# Altium schematic sheet Template.SchDoc
size A3; Organization: Altium Limited; Address1: L3, 12a Rodborough Rd; Address2: Frenchs Forest; Address3: NSW; Address4: Australia 2086
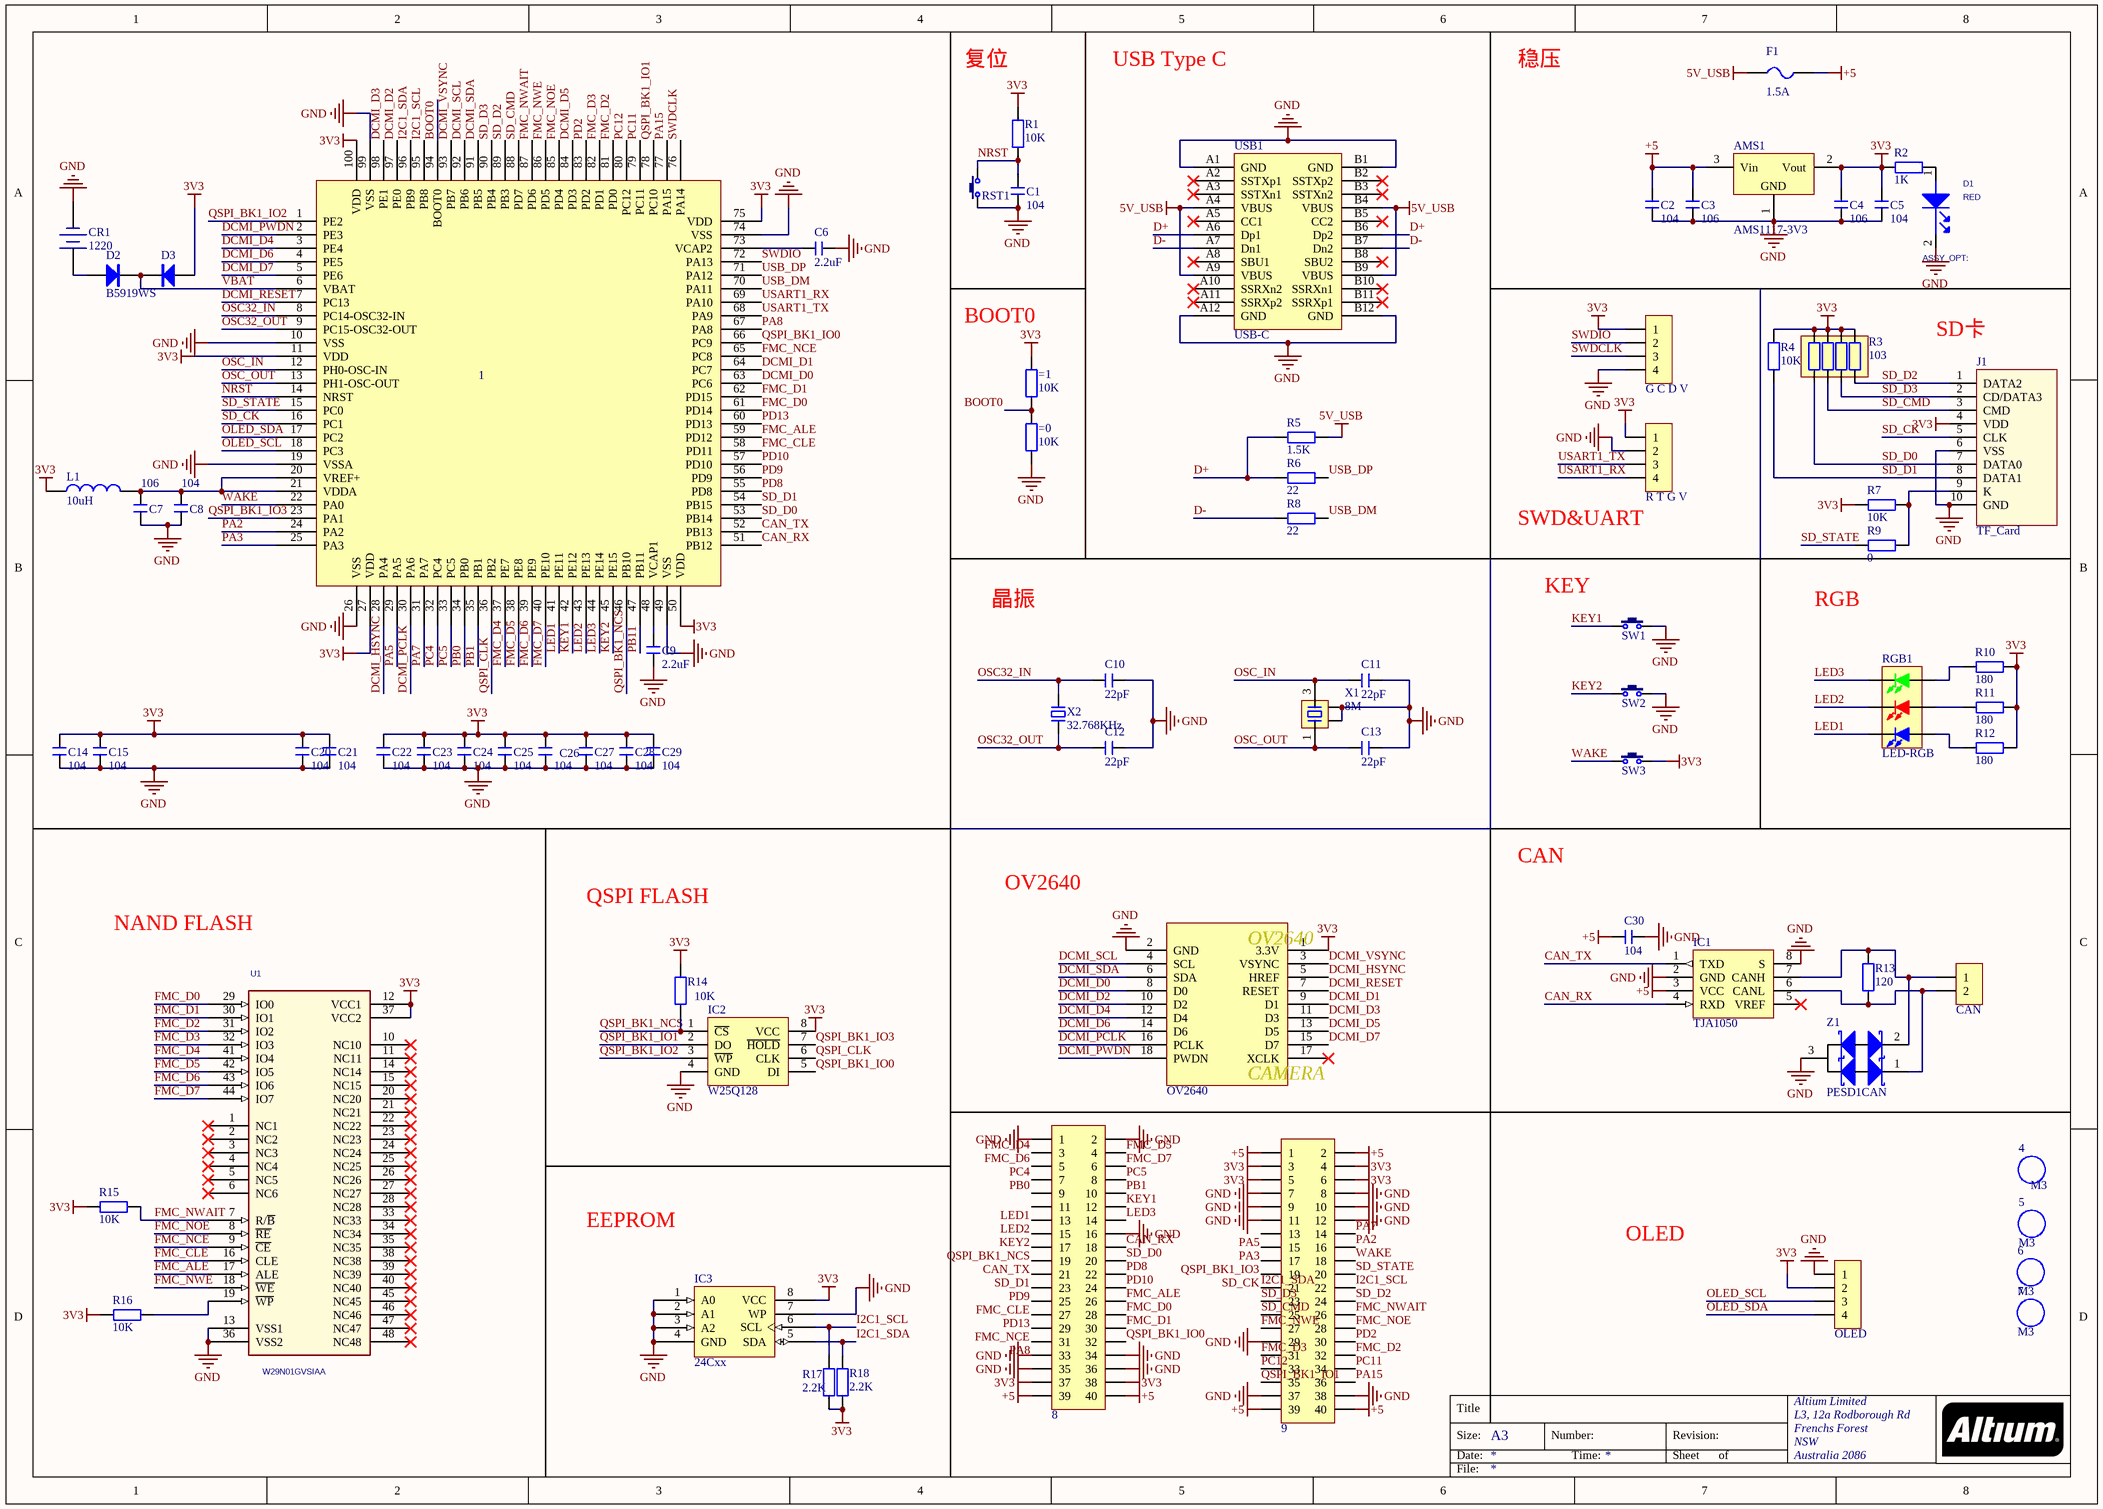
[diagram p0: Template.SchDoc]

## Parts
1  (no value)  [LQFP100 14x14_M]
4  M3  [M3 125X200]
5  M3  [M3 125X200]
6  M3  [M3 125X200]
7  M3  [M3 125X200]
8  Header 2X11  [HDR2.54-LI-2x20P]  (value not drawn)
9  Header 2X11  [HDR2.54-LI-2x20P]  (value not drawn)
=0  10K  [R 0603_L]
=1  10K  [R 0603_L]
AMS1  AMS1117-3V3  [SOT223_N]
C1  104  [C 0603_L]
C2  104  [C 0603_L]
C3  106  [C 0805_M]
C4  106  [C 0805_M]
C5  104  [C 0603_L]
C6  2.2uF  [C 0603_L]
C7  106  [C 0805_M]
C8  104  [C 0603_L]
C9  2.2uF  [C 0603_L]
C10  22pF  [C 0603_L]
C11  22pF  [C 0603_L]
C12  22pF  [C 0603_L]
C13  22pF  [C 0603_L]
C14  104  [C 0603_L]
C15  104  [C 0603_L]
C20  104  [C 0603_L]
C21  104  [C 0603_L]
C22  104  [C 0603_L]
C23  104  [C 0603_L]
C24  104  [C 0603_L]
C25  104  [C 0603_L]
C26  104  [C 0603_L]
C27  104  [C 0603_L]
C28  104  [C 0603_L]
C29  104  [C 0603_L]
C30  104  [C 0603_L]
CAN  HDR-1X2  [KF301-5.0-2P]  (value not drawn)
CR1  1220  [CR1220_A]
D1  RED  [LED0603]
D2  B5919WS  [SOD-323]
D3  (no value)  [SOD-323]
F1  1.5A  [FU 1812]
G_C_D_V  HDR-1X4  [HDR2.54-WI-4P]  (value not drawn)
IC1  TJA1050  [SOP8_N]
IC2  W25Q128  [SOP8W_N]
IC3  24Cxx  [SOP8_L]
J1  TF_Card  [Micro SD]
L1  10uH  [L 0805]
OLED  OLED  [HDR2.54-M-LI-4P]  (value not drawn)
OV2640  OV2640  [OV2640]  (value not drawn)
R1  10K  [R 0603_L]
R2  1K  [R 0603_L]
R3  103  [RCA-8P4R-0603]
R4  10K  [R 0603_L]
R5  1.5K  [R 0603_L]
R6  22  [R 0603_L]
R7  10K  [R 0603_L]
R8  22  [R 0603_L]
R9  0  [R 0603_L]
R10  180  [R 0603_L]
R11  180  [R 0603_L]
R12  180  [R 0603_L]
R13  120  [R 0603_L]
R14  10K  [R 0603_L]
R15  10K  [R 0603_L]
R16  10K  [R 0603_L]
R17  2.2K  [R 0603_L]
R18  2.2K  [R 0603_L]
R_T_G_V  HDR-1X4  [HDR2.54-LI-4P]  (value not drawn)
RGB1  LED-RGB  [LED 5050]
RST1  3x6x5  [TSW SMD-3*6*2.5]  (value not drawn)
SW1  3x6x5  [TSW SMD-3*6*2.5]  (value not drawn)
SW2  3x6x5  [TSW SMD-3*6*2.5]  (value not drawn)
SW3  3x6x5  [TSW SMD-3*6*2.5]  (value not drawn)
U1  W29N01GVSIAA  [TSOP48]
USB1  USB-C  [USB-C/S_A]
X1  8M  [OSC 5032-4P]
X2  32.768KHz  [OSC-2x6-WI-B]
Z1  PESD1CAN  [SOT23-3]

## Nets
3V3: 1.11(VDD) 1.27(VDD) 1.50(VDD) 1.75(VDD) 1.100(VDD) 8.37 8.38 9.3 9.4 9.5 9.6 =1.1 AMS1.2(Vout) C4.2 C5.2 C14.1 C15.1 C20.1 C21.1 C22.1 C23.1 C24.1 C25.1 C26.1 C27.1 C28.1 C29.1 D3.1(A) G_C_D_V.1 IC2.8(VCC) IC3.8(VCC) J1.4(VDD) L1.1 OLED.2 OV2640.1(3.3V) R1.1 R2.2 R3.5 R3.6 R3.7 R3.8 R4.2 R7.1 R10.2 R11.2 R12.2 R14.1 R15.1 R16.1 R17.1 R18.2 R_T_G_V.1 SW3.2 U1.12(VCC1) U1.37(VCC2)
5V_USB: F1.1 R5.2 USB1.A4(VBUS) USB1.A9(VBUS) USB1.B4(VBUS) USB1.B9(VBUS)
+5: 8.39 8.40 9.1 9.2 9.39 9.40 AMS1.3(Vin) C2.2 C3.2 C30.1 F1.2 IC1.3(VCC)
GND: 1.10(VSS) 1.19(VSSA) 1.26(VSS) 1.49(VSS) 1.74(VSS) 1.99(VSS) 8.1 8.2 8.16 8.33 8.34 8.35 8.36 9.7 9.8 9.9 9.10 9.11 9.12 9.29 9.37 9.38 =0.2 AMS1.1(GND) C1.1 C2.1 C3.1 C4.1 C5.1 C6.2 C7.2 C8.2 C9.1 C10.1 C11.1 C12.1 C13.1 C14.2 C15.2 C20.2 C21.2 C22.2 C23.2 C24.2 C25.2 C26.2 C27.2 C28.2 C29.2 C30.2 CR1.2(DC-) D1.2(CATHODE) G_C_D_V.4 IC1.2(GND) IC1.8(S) IC2.4(GND) IC3.1(A0) IC3.2(A1) IC3.3(A2) IC3.4(GND) IC3.7(WP) J1.6(VSS) J1.10(GND) OLED.1 OV2640.2(GND) R_T_G_V.2 RST1.1 SW1.2 SW2.2 U1.13(VSS1) U1.36(VSS2) USB1.A1(GND) USB1.A12(GND) USB1.B1(GND) USB1.B12(GND) X1.2 X1.4 Z1.3
BOOT0: 1.94(BOOT0) =0.1 =1.2
CAN_RX: 1.51(PB12) 8.18 IC1.4(RXD)
CAN_TX: 1.52(PB13) 8.19 IC1.1(TXD)
D+: R5.1 R6.2 USB1.A6(Dp1) USB1.B6(Dp2)
D-: R8.2 USB1.A7(Dn1) USB1.B7(Dn2)
DCMI_D0: 1.63(PC6) OV2640.8(D0)
DCMI_D1: 1.64(PC7) OV2640.9(D1)
DCMI_D2: 1.97(PE0) OV2640.10(D2)
DCMI_D3: 1.98(PE1) OV2640.11(D3)
DCMI_D4: 1.3(PE4) OV2640.12(D4)
DCMI_D5: 1.84(PD3) OV2640.13(D5)
DCMI_D6: 1.4(PE5) OV2640.14(D6)
DCMI_D7: 1.5(PE6) OV2640.15(D7)
DCMI_HSYNC: 1.28(PA4) OV2640.5(HREF)
DCMI_PCLK: 1.30(PA6) OV2640.16(PCLK)
DCMI_PWDN: 1.2(PE3) OV2640.18(PWDN)
DCMI_RESET: 1.7(PC13) OV2640.7(RESET)
DCMI_SCL: 1.92(PB6) OV2640.4(SCL)
DCMI_SDA: 1.91(PB5) OV2640.6(SDA)
DCMI_VSYNC: 1.93(PB7) OV2640.3(VSYNC)
FMC_ALE: 1.59(PD12) 8.26 U1.17(ALE)
FMC_CLE: 1.58(PD11) 8.25 U1.16(CLE)
FMC_D0: 1.61(PD14) 8.28 U1.29(IO0)
FMC_D1: 1.62(PD15) 8.30 U1.30(IO1)
FMC_D2: 1.81(PD0) 9.32 U1.31(IO2)
FMC_D3: 1.82(PD1) 9.31 U1.32(IO3)
FMC_D4: 1.37(PE7) 8.3 U1.41(IO4)
FMC_D5: 1.38(PE8) 8.4 U1.42(IO5)
FMC_D6: 1.39(PE9) 8.5 U1.43(IO6)
FMC_D7: 1.40(PE10) 8.6 U1.44(IO7)
FMC_NCE: 1.65(PC8) 8.29 U1.9(~{CE})
FMC_NOE: 1.85(PD4) 9.28 U1.8(~{RE})
FMC_NWAIT: 1.87(PD6) 9.26 R15.2 U1.7(R/~{B})
FMC_NWE: 1.86(PD5) 9.27 U1.18(~{WE})
I2C1_SCL: 1.95(PB8) 9.22 IC3.6(SCL) R17.2
I2C1_SDA: 1.96(PB9) 9.21 IC3.5(SDA) R18.1
KEY1: 1.42(PE12) 8.12 SW1.1
KEY2: 1.45(PE15) 8.15 SW2.1
LED1: 1.41(PE11) 8.11 RGB1.1(BULE_K)
LED2: 1.43(PE13) 8.13 RGB1.3(RED_K)
LED3: 1.44(PE14) 8.14 RGB1.5(GREEN_K)
NRST: 1.14(NRST) C1.2 R1.2 RST1.2
OLED_SCL: 1.18(PC3) OLED.3
OLED_SDA: 1.17(PC2) OLED.4
OSC32_IN: 1.8(PC14-OSC32-IN) C10.2 X2.1
OSC32_OUT: 1.9(PC15-OSC32-OUT) C12.2 X2.2
OSC_IN: 1.12(PH0-OSC-IN) C11.2 X1.3
OSC_OUT: 1.13(PH1-OSC-OUT) C13.2 X1.1
PA2: 1.24(PA2) 9.16
PA3: 1.25(PA3) 9.15
PA5: 1.29(PA5) 9.13
PA7: 1.31(PA7) 9.14
PA8: 1.67(PA8) 8.31
PA15: 1.77(PA15) 9.36
PB0: 1.34(PB0) 8.9
PB1: 1.35(PB1) 8.10
PB11: 1.47(PB11)
PC4: 1.32(PC4) 8.7
PC5: 1.33(PC5) 8.8
PC11: 1.79(PC11) 9.34
PC12: 1.80(PC12) 9.33
PD2: 1.83(PD2) 9.30
PD8: 1.55(PD8) 8.22
PD9: 1.56(PD9) 8.23
PD10: 1.57(PD10) 8.24
PD13: 1.60(PD13) 8.27
QSPI_BK1_IO0: 1.66(PC9) 8.32 IC2.5(DI)
QSPI_BK1_IO1: 1.78(PC10) 9.35 IC2.2(DO)
QSPI_BK1_IO2: 1.1(PE2) IC2.3(~{WP})
QSPI_BK1_IO3: 1.23(PA1) 9.17 IC2.7(~{HOLD})
QSPI_BK1_NCS: 1.46(PB10) 8.17 IC2.1(~{CS}) R14.2
QSPI_CLK: 1.36(PB2) IC2.6(CLK)
SD_CK: 1.16(PC1) 9.19 J1.5(CLK)
SD_CMD: 1.88(PD7) 9.25 J1.3(CMD) R3.2
SD_D0: 1.53(PB14) 8.20 J1.7(DATA0) R3.1
SD_D1: 1.54(PB15) 8.21 J1.8(DATA1) R4.1
SD_D2: 1.89(PB3) 9.24 J1.1(DATA2) R3.4
SD_D3: 1.90(PB4) 9.23 J1.2(CD/DATA3) R3.3
SD_STATE: 1.15(PC0) 9.20 R9.2
SWDCLK: 1.76(PA14) G_C_D_V.3
SWDIO: 1.72(PA13) G_C_D_V.2
USART1_RX: 1.69(PA10) R_T_G_V.4
USART1_TX: 1.68(PA9) R_T_G_V.3
USB_DM: 1.70(PA11) R8.1
USB_DP: 1.71(PA12) R6.1
VBAT: 1.6(VBAT) D2.2(K) D3.2(K)
WAKE: 1.22(PA0) 9.18 SW3.1
Net1_20: 1.20(VREF+) 1.21(VDDA) C7.1 C8.1 L1.2
Net1_48: 1.48(VCAP1) C9.2
Net1_73: 1.73(VCAP2) C6.1
NetCAN_1: CAN.1 IC1.7(CANH) R13.2 Z1.2
NetCAN_2: CAN.2 IC1.6(CANL) R13.1 Z1.1
NetCR1_1: CR1.1(DC+) D2.1(A)
NetD1_1: D1.1(ANODE) R2.1
NetJ1_9: J1.9(K) R7.2 R9.1
NetR10_1: R10.1 RGB1.6(GREEN_A)
NetR11_1: R11.1 RGB1.4(RED_A)
NetR12_1: R12.1 RGB1.2(BULE_A)
NetR16_2: R16.2 U1.19(~{WP})

Not connected (* = marked no-connect by the designer): IC1 5(VREF)*; OV2640 17(XCLK)*; U1 1(NC1)* 2(NC2)* 3(NC3)* 4(NC4)* 5(NC5)* 6(NC6)* 10(NC10)* 11(NC11)* 14(NC14)* 15(NC15)* 20(NC20)* 21(NC21)* 22(NC22)* 23(NC23)* 24(NC24)* 25(NC25)* 26(NC26)* 27(NC27)* 28(NC28)* 33(NC33)* 34(NC34)* 35(NC35)* 38(NC38)* 39(NC39)* 40(NC40)* 45(NC45)* 46(NC46)* 47(NC47)* 48(NC48)*; USB1 A2(SSTXp1)* A3(SSTXn1)* A5(CC1)* A8(SBU1)* A10(SSRXn2)* A11(SSRXp2)* B2(SSTXp2)* B3(SSTXn2)* B5(CC2)* B8(SBU2)* B10(SSRXn1)* B11(SSRXp1)*

## Notes on the sheet
- 复位
- USB Type C
- 稳压
- (near =1) BOOT0
- (near J1) SD卡
- (near R_T_G_V) SWD&UART
- 晶振
- KEY
- (near R9) RGB
- QSPI FLASH
- OV2640
- CAN
- NAND FLASH
- EEPROM
- OLED
- Title
- Size:
- Date:
- A3
- Number:
- Time:
- Revision:
- Sheet
- of
- File:
- (in symbol OV2640) CAMERA

## Library data of the parts
1 = stm32h750vbt6
4-7 = M3: 铜柱孔; 版权归属: 源创客; BOM名称: 铜柱孔; 学习资源: www.ooocke.com
8 9 = Header 20X2: 20*2P接插件; 版权归属: 源创客; BOM名称: 20*2P接插件; 学习资源: www.ooocke.com
=0 =1 R1 R2 R4-R18 = R: 贴片电阻; 版权归属: 源创客; BOM名称: 贴片电阻; 学习资源: www.ooocke.com
AMS1 = AMS1117: 三端稳压芯片; BOM名称: 稳压芯片; 版权归属: 源创客; 学习资源: www.ooocke.com
C1-C15 C20-C30 = C: 无极性贴片电容; 版权归属: 源创客; BOM名称: 无极性贴片电容; 学习资源: www.ooocke.com
CAN = Header 2: 2P接插件; 版权归属: 源创客; BOM名称: 2P接插件; 学习资源: www.ooocke.com
CR1 = CR-3V: 微型电池; 版权归属: 源创客; BOM名称: 微型电池; 学习资源: www.ooocke.com
D1 = LED_0: LED GRN SGL 25MA 0603; CLASS: IC; AGILE_PN: 370-76549; MFG_NAME01: KINGBRIGHT; MFG_PN01: KPT-1608SGC; CAD_APPROVED: Yes; ROHS: Yes; HEIGHT: 0.85MM
D2 D3 = 1N5819: 肖特基二极管; 版权归属: 源创客; 属性: 40V/2A; BOM名称: 肖特基二极管; 学习资源: www.ooocke.com
F1 = FU: 贴片保险丝; 版权归属: 源创客; BOM名称: 贴片保险丝; 学习资源: www.ooocke.com
G_C_D_V OLED R_T_G_V = Header 4: 4P接插件; 版权归属: 源创客; BOM名称: 4P接插件; 学习资源: www.ooocke.com
IC1 = TJA1050: CAN总线收发芯片; 版权归属: 源创客; BOM名称: CAN总线收发芯片; 学习资源: www.ooocke.com
IC2 = W25Qxx: 外置Flash; 版权归属: 源创客; BOM名称: 外置Flash; 学习资源: www.ooocke.com
IC3 = 24Cxx: 外置EEPROM; 版权归属: 源创客; BOM名称: 外置EEPROM; 学习资源: www.ooocke.com
J1 = TF_Card: TF卡座; 版权归属: 源创客; BOM名称: TF卡座; 学习资源: www.ooocke.com
L1 = L: 小功率贴片电感; 版权归属: 源创客; BOM名称: 小功率贴片电感; 学习资源: www.ooocke.com
OV2640 = OV2640: 摄像头
R3 = R-8P4R: 贴片网络排阻; 版权归属: 源创客; BOM名称: 贴片网络排阻; 学习资源: www.ooocke.com
RGB1 = LED-RGB: 三基色LED; 版权归属: 源创客; BOM名称: 三基色LED; 学习资源: www.ooocke.com
RST1 SW1-SW3 = TSW 3x6: 3x6轻触开关; 版权归属: 源创客; BOM名称: 3x6轻触开关; 学习资源: www.ooocke.com
U1 = W29N01GVSIAA: IC MEM SDRAM 16MX16 6NS 3.3V VFBGA54; AGILE_PN: 334-77696; MFG_NAME01: MICRON; MFG_PN01: MT48LC16M16A2B4-6A IT:G; CAD_APPROVED: Yes; CLASS: IC; ROHS: Yes; HEIGHT: 1 MM
USB1 = USB-C/S: USB-C型母接口; 版权归属: 源创客; BOM名称: USB-C型母接口; 学习资源: www.ooocke.com
X1 = XTAL-4P: 4脚无源晶振; 版权归属: 源创客; BOM名称: 4脚无源晶振; 学习资源: www.ooocke.com
X2 = XTAL-2P: 2脚无源脚晶振; 版权归属: 源创客; BOM名称: 2脚无源脚晶振; 学习资源: www.ooocke.com
Z1 = PESD1CAN: 过压保护